# EAGLE design AccelModule3AxisMMA7361 (EAGLE 5.10)
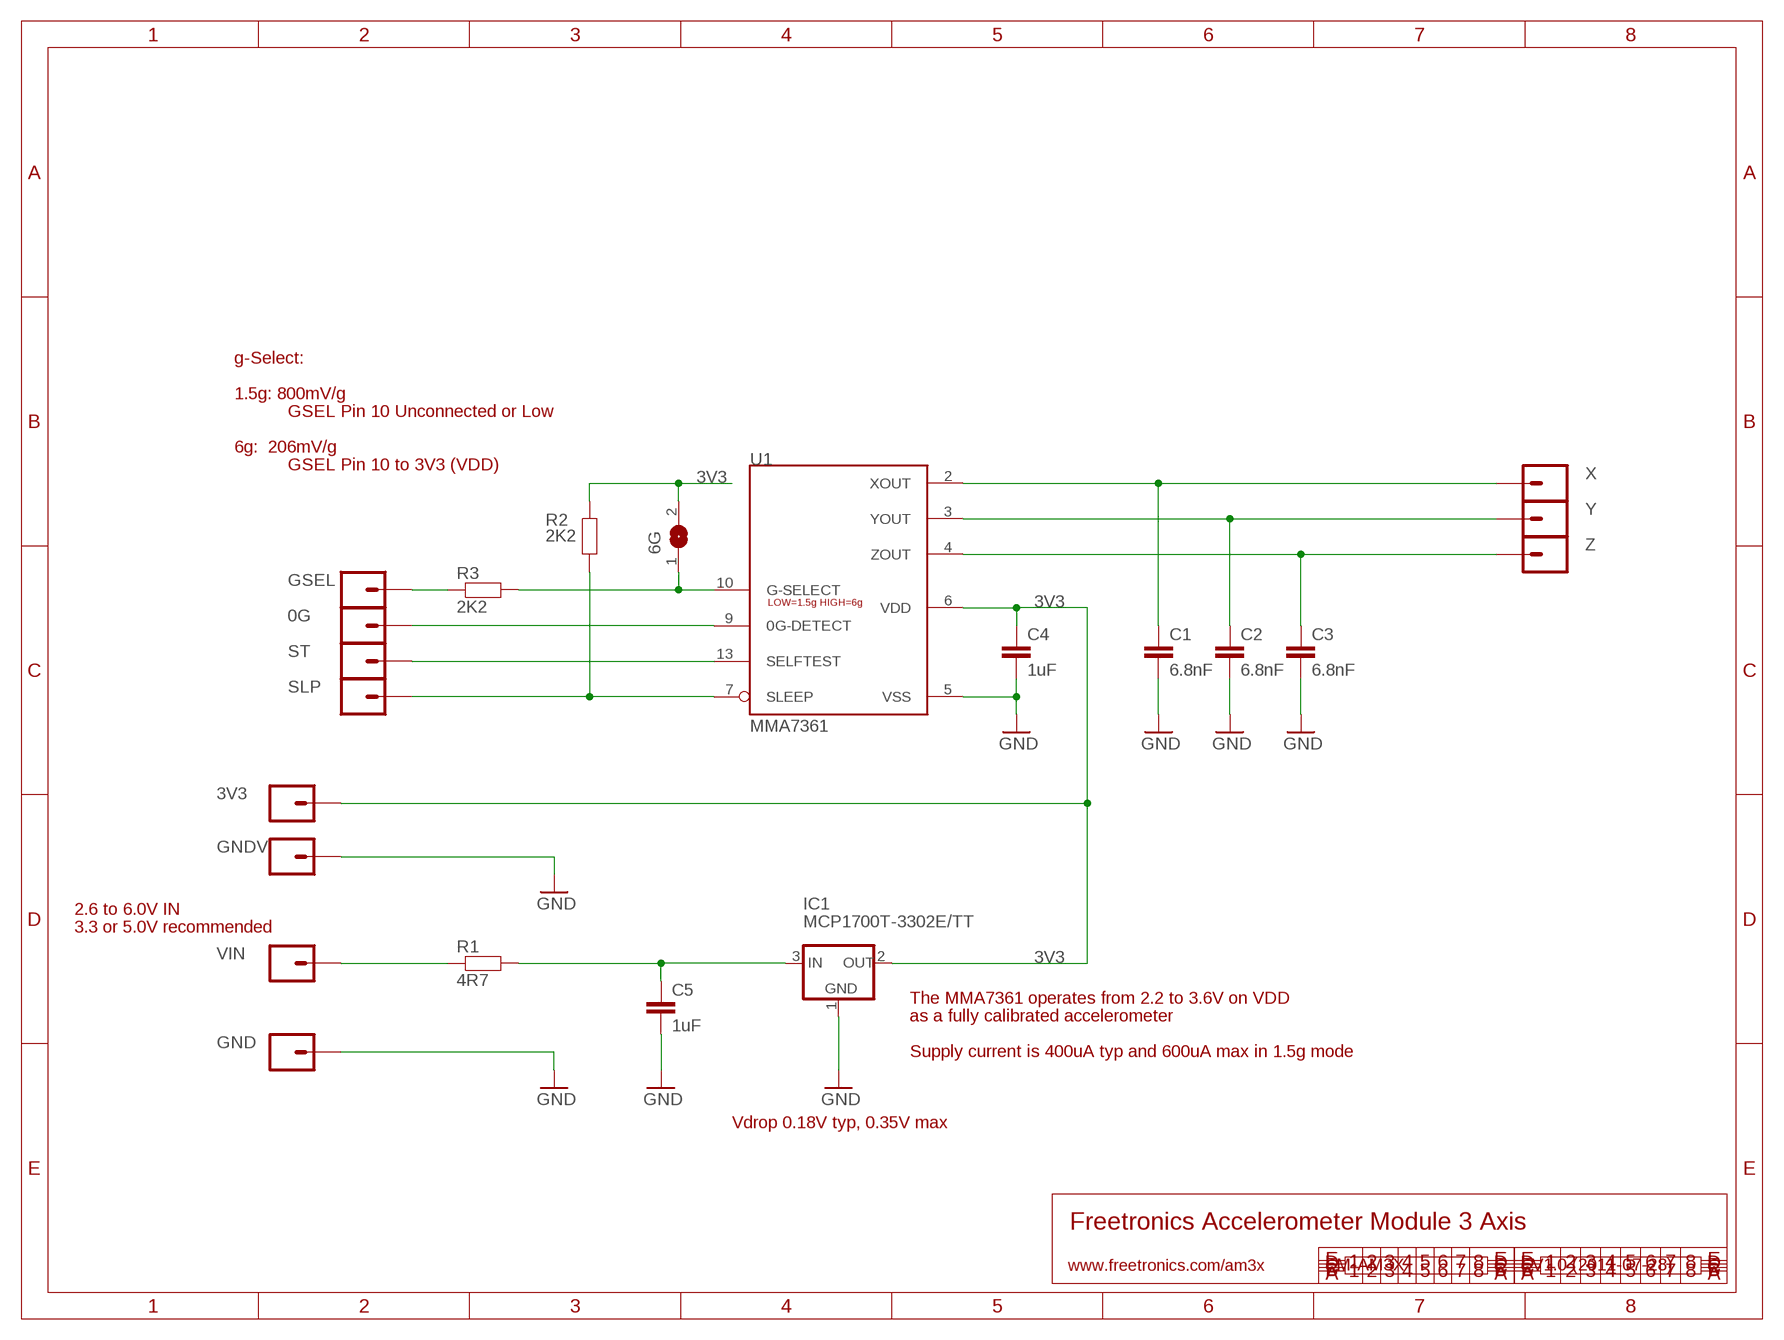
[diagram p0: schematic, sheet 1]

## Parts
0G  M01PTH  [1X01]
3V3  M01PTH  [1X01]
6G  SJ  [SJ]
C1  6.8nF  CAP0603  [0603]
C2  6.8nF  CAP0603  [0603]
C3  6.8nF  CAP0603  [0603]
C4  1uF  CAP0603  [0603]
C5  1uF  CAP0603  [0603]
GND  M01PTH  [1X01]
GNDV  M01PTH  [1X01]
GSEL  M01PTH  [1X01]
IC1  MCP1700T-3302E/TT  V_REG_78XXSOT23-3  [SOT23-3]
R1  4R7  RESISTOR0603  [0603]
R2  2K2  RESISTOR0603  [0603]
R3  2K2  RESISTOR0603  [0603]
SLP  M01PTH  [1X01]
ST  M01PTH  [1X01]
U1  MMA7361  [LGA14]
VIN  M01PTH  [1X01]
X  M01PTH  [1X01]
Y  M01PTH  [1X01]
Z  M01PTH  [1X01]

## Nets
3V3: 3V3.1 6G.2 C4.1 IC1.2(OUT) R2.2 U1.6(VDD)
GND: C1.2 C2.2 C3.2 C4.2 C5.2 GND.1 GNDV.1 IC1.1(GND) U1.5(VSS)
N$1: 6G.1 R3.2 U1.10(G-SELECT)
N$2: 0G.1 U1.9(0G-DETECT)
N$3: C1.1 U1.2(XOUT) X.1
N$4: C2.1 U1.3(YOUT) Y.1
N$5: C3.1 U1.4(ZOUT) Z.1
N$6: C5.1 IC1.3(IN) R1.2
N$7: ST.1 U1.13(SELFTEST)
N$8: R2.1 SLP.1 U1.7(SLEEP)
N$9: GSEL.1 R3.1
N$10: R1.1 VIN.1

## Notes on the sheet
- g-Select:
- 1.5g: 800mV/g
- GSEL Pin 10 Unconnected or Low
- 6g:  206mV/g
- GSEL Pin 10 to 3V3 (VDD)
- 2.6 to 6.0V IN
- 3.3 or 5.0V recommended
- The MMA7361 operates from 2.2 to 3.6V on VDD
- as a fully calibrated accelerometer
- Supply current is 400uA typ and 600uA max in 1.5g mode
- Vdrop 0.18V typ, 0.35V max
- Freetronics Accelerometer Module 3 Axis
- www.freetronics.com/am3x | M-AM3X | V1.0 (2011-07-28)

## Library data of the parts
0G 3V3 GND GNDV GSEL SLP ST VIN X Y Z = freetronics-master-v1:M01: Header 1 Standard 1-pin 0.1" header. Use with straight break away headers (SKU : PRT-00116), right angle break away headers (PRT-00553), swiss pins (PRT-00743), machine pins (PRT-00117), and female headers (PRT-00115).
6G = freetronics-master-v1:SJ: SMD solder JUMPER
C1-C5 = freetronics-master-v1:CAP: Capacitor Standard 0603 ceramic capacitor, and 0.1" leaded capacitor.
IC1 = freetronics-master-v1:V_REG_78XX
R1-R3 = freetronics-master-v1:RESISTOR: Resistor Basic schematic elements and footprints for 0603, 1206, and PTH 1/10th watt (small) resistors.
U1 = freetronics-master-v1:MMA7361

## Board
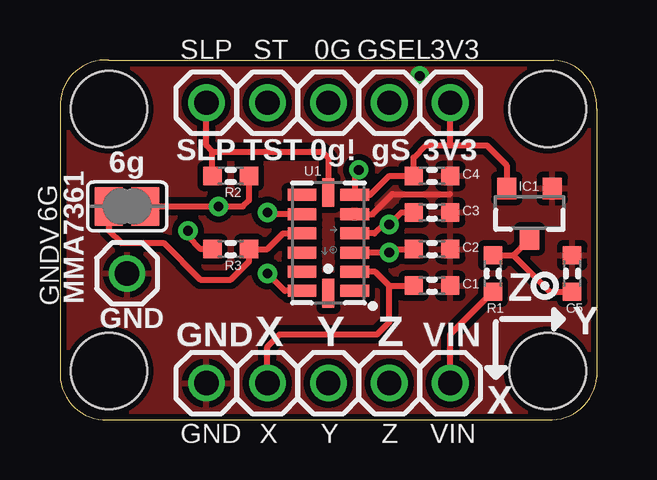
[diagram p1: board, top side]
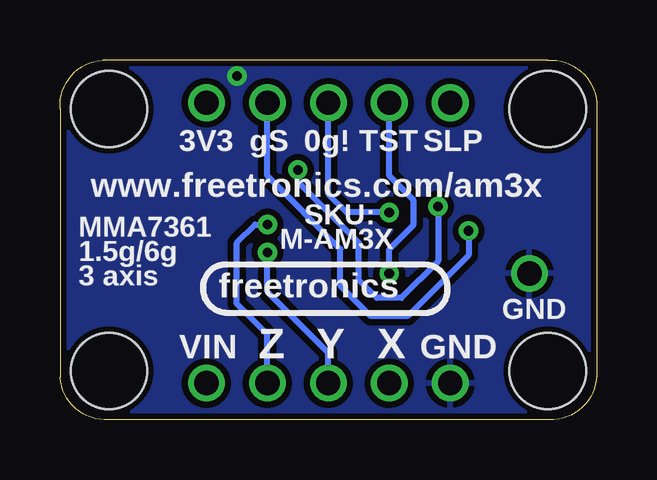
[diagram p2: board, bottom side, seen from below]

Size 22.36 x 14.99 mm. Coordinates in mm from the lower left corner, seen from the top.
Outline: 0,2.04 arc90 1.78,0 20.32,0 arc90 22.36,1.78 22.36,12.96 arc90 20.58,14.99 2.04,14.99 arc90 0,13.21 0,2.04
Copper layers (1*16): Top 0.035mm / dielectric 1.5mm / Bottom 0.035mm
Design rules "default *": minimum track width 8mil, minimum drill 15mil, track to track 10mil, track to pad 10mil, pad to pad 10mil, via to via 10mil, smd to smd 8mil, copper to edge 10mil, drill to drill 8mil, minimum pad ring 10mil, minimum via ring 8mil, stop-mask expansion 4mil, vias tented up to drill 25mil, thermal gap 10mil
Holes 3.17 mm at 2.04,2.04 20.32,2.04 2.04,12.96 20.32,12.96

### Footprints (pad centres in the part's own frame; a part is rotated, then mirrored left to right if it is on the bottom)
1X01 = drill 1.016 round: 1 0,0
SJ = smd 1.168 x 1.6: 1 -0.762,0; 2 0.762,0
0603 = smd 0.762 x 0.762: 1 -0.762,0; 2 0.762,0
SOT23-3 = smd 0.8 x 0.9: 1 -0.95,-1; 2 0.95,-1; 3 0,1.1
LGA14 = smd 0.5 x 1.2: 1 2,1.1; 2 1.2,1.1; 3 0.4,1.1; 4 -0.4,1.1; 5 -1.2,1.1; 6 -2,1.1; 8 -2,-1.1; 9 -1.2,-1.1; 10 -0.4,-1.1; 11 0.4,-1.1; 12 1.2,-1.1; 13 2,-1.1 | smd 1.2 x 0.5: 7 -2.1,0; 14 2.1,0

### Placement (x,y rotation side)
0G  11.18,13.21 0 top
3V3  16.26,13.21 0 top
6G  2.8,8.89 0 top
C1  15.5,5.59 0 top
C2  15.5,7.12 0 top
C3  15.5,8.64 0 top
C4  15.5,10.16 0 top
C5  21.34,6.1 90 top
GND  6.1,1.53 0 top
GNDV  2.8,6.1 0 top
GSEL  13.72,13.21 0 top
IC1  19.56,8.64 180 top
R1  18.04,6.1 90 top
R2  7.12,10.16 0 top
R3  7.12,7.12 0 top
SLP  6.1,13.21 0 top
ST  8.64,13.21 0 top
U1  11.18,7.37 270 top
VIN  16.26,1.53 0 top
X  8.64,1.53 0 top
Y  11.18,1.53 0 top
Z  13.72,1.53 0 top

### Tracks (layer width: path | path; a pad name or v marks a point on that pad's centre or on a via)
3V3  (via drill 0.4)
  Top 0.254: IC1.2 18.61,10.61 17.78,11.43 16.26,11.43 | 16.26,11.43 15.24,11.43 14.74,10.93 C4.1 13.72,10.16 12.93,9.37 U1.6 12.28,10.25 v12.45,10.42 | 16.26,11.43 3V3.1 | 6G.2 v6.61,8.89 7.62,8.89 7.88,9.15 R2.2
  Bottom 0.254: v12.45,10.42 12.45,9.91 9.91,7.37 9.91,5.85 9.15,5.08 8.13,5.08 6.61,6.61 v6.61,8.89
GND  (via drill 0.4)
  Top 0.254: U1.5 13.01,8.57 13.85,9.4 16.26,9.4
  other vias: 14.99,14.33
  pour Top: 0,2.04 0,13.21 arc-90 1.78,14.99 20.58,14.99 arc-90 22.36,13.21 22.36,1.78 arc-90 20.58,0 1.78,0 arc-98
  pour Bottom: 0,2.04 0,13.21 arc-90 1.78,14.99 20.58,14.99 arc-90 22.36,13.21 22.36,1.78 arc-90 20.58,0 1.78,0 arc-98
N$1
  Top 0.254: U1.10 9.29,7.77 8.64,7.12 R3.2 7.88,6.61 7.12,5.85 5.85,5.85 4.32,7.37 2.54,7.37 2.04,7.88 6G.1
N$2  (via drill 0.4)
  Top 0.254: U1.9 8.71,8.57 v8.64,8.64
  Bottom 0.254: v8.64,8.64 10.42,8.64 11.18,9.4 0G.1
N$3
  Top 0.254: U1.2 13.14,6.17 13.72,5.59 | 13.72,5.59 C1.1 | X.1 8.64,3.05 9.15,3.56 13.21,3.56 13.72,4.07 13.72,5.59
N$4  (via drill 0.4)
  Top 0.254: C2.1 13.97,7.12 13.83,6.97 v13.72,6.97 U1.3
  Bottom 0.254: Y.1 11.18,2.8 13.72,5.34 v13.72,6.97
N$5  (via drill 0.4)
  Top 0.254: U1.4 13.1,7.77 13.47,8.13 v13.72,8.13 14.23,8.64 C3.1
  Bottom 0.254: Z.1 13.72,3.56 14.99,4.83 14.99,7.37 14.23,8.13 v13.72,8.13
N$6
  Top 0.254: R1.2 18.88,6.86 | 18.88,6.86 IC1.3 | C5.1 20.41,5.34 18.88,6.86
N$7  (via drill 0.4)
  Top 0.254: U1.13 9.37,5.37 v8.64,6.1
  Bottom 0.254: v8.64,6.1 8.64,7.12 7.62,8.13 7.62,9.15 8.64,10.16 ST.1
N$8
  Top 0.254: SLP.1 6.1,11.43 6.35,11.18 | R2.1 6.35,11.18 | U1.7 11.18,10.93 10.93,11.18 6.35,11.18
N$9  (via drill 0.4)
  Top 0.254: R3.1 5.85,7.12 5.34,7.62 v5.34,7.88
  Bottom 0.254: v5.34,7.88 5.34,6.86 7.88,4.32 9.4,4.32 10.67,5.59 10.67,7.12 13.72,10.16 GSEL.1
N$10
  Top 0.254: VIN.1 16.26,3.56 R1.1

### Text on the board
tPlace: SLP | TST | 0g! | gS | 3V3 | 6g | MMA7361 | Z | GND | Y | GND | X | Y | Z | VIN | X
bPlace: SLP | TST | 0g! | gS | 3V3 | www.freetronics.com/am3x | SKU: | MMA7361 | M-AM3X | 1.5g/6g | 3 axis | freetronics | GND | GND | X | Y | Z | VIN